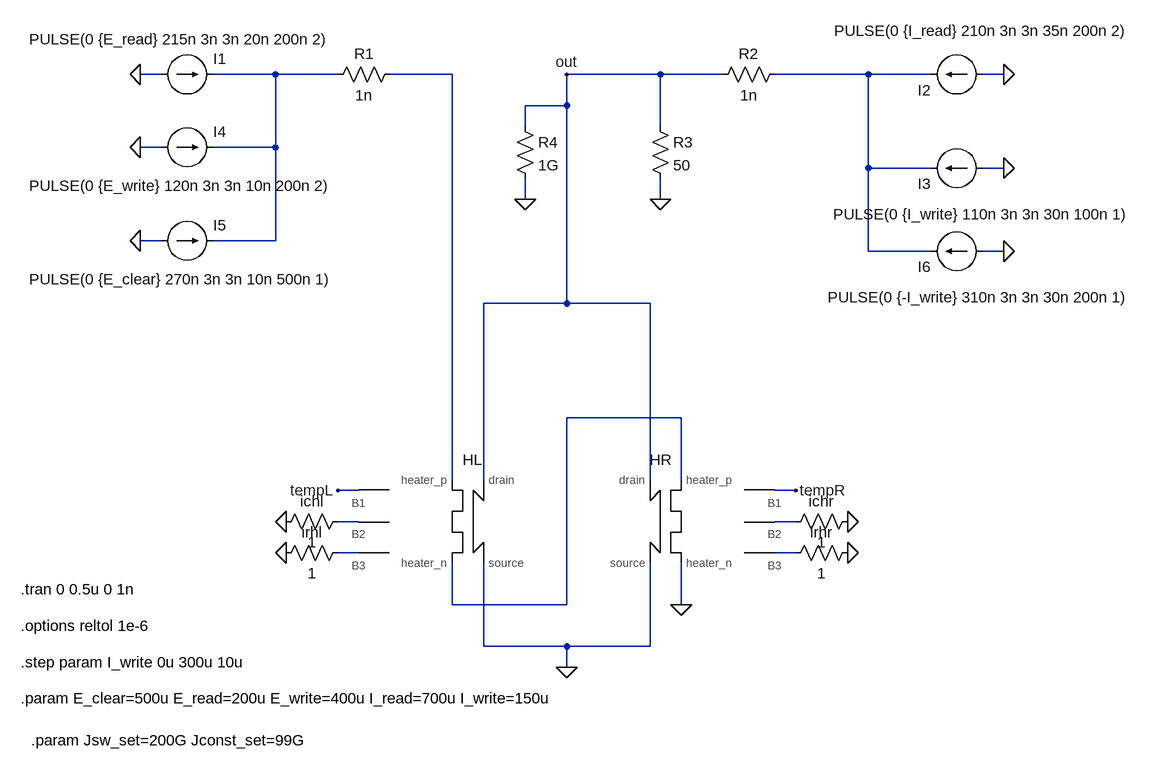
[diagram p0: schematic nmem_cell_write.asc]
nmem_cell_write.asc, the LTspice schematic file:
Version 4.1
SHEET 1 2708 1228
WIRE -400 32 -432 32
WIRE -224 32 -320 32
WIRE -128 32 -224 32
WIRE 48 32 -48 32
WIRE 368 32 224 32
WIRE 464 32 368 32
WIRE 688 32 544 32
WIRE 784 32 688 32
WIRE 896 32 864 32
WIRE 224 80 224 32
WIRE 224 80 160 80
WIRE 160 112 160 80
WIRE 368 112 368 32
WIRE -400 144 -432 144
WIRE -224 144 -224 32
WIRE -224 144 -320 144
WIRE 688 176 688 32
WIRE 784 176 688 176
WIRE 896 176 864 176
WIRE 160 224 160 192
WIRE 368 224 368 192
WIRE -400 288 -432 288
WIRE -224 288 -224 144
WIRE -224 288 -320 288
WIRE 688 304 688 176
WIRE 784 304 688 304
WIRE 896 304 864 304
WIRE 224 384 224 80
WIRE 224 384 96 384
WIRE 352 384 224 384
WIRE 400 560 224 560
WIRE 48 656 48 32
WIRE 96 656 96 384
WIRE 352 656 352 384
WIRE 400 656 400 560
WIRE -96 672 -128 672
WIRE 576 672 544 672
WIRE -96 720 -128 720
WIRE 576 720 544 720
WIRE -96 768 -128 768
WIRE 576 768 544 768
WIRE 48 848 48 784
WIRE 224 848 224 560
WIRE 224 848 48 848
WIRE 400 848 400 784
WIRE 96 912 96 784
WIRE 224 912 96 912
WIRE 352 912 352 784
WIRE 352 912 224 912
WIRE 224 944 224 912
FLAG -432 32 0
FLAG 896 176 0
FLAG 224 32 out
FLAG 224 944 0
FLAG 400 848 0
FLAG 896 32 0
FLAG -432 144 0
FLAG 368 224 0
FLAG -128 672 tempL
FLAG -432 288 0
FLAG 896 304 0
FLAG 160 224 0
FLAG 576 672 tempR
FLAG -208 720 0
FLAG -208 768 0
FLAG 656 768 0
FLAG 656 720 0
SYMBOL current -400 32 R270
WINDOW 0 24 80 VRight 2
WINDOW 3 54 -203 VRight 2
WINDOW 123 0 0 Left 0
WINDOW 39 0 0 Left 0
SYMATTR InstName I1
SYMATTR Value PULSE(0 {E_read} 215n 3n 3n 20n 200n 2)
SYMBOL current 864 32 R90
WINDOW 0 24 80 VRight 2
WINDOW 3 -67 -228 VRight 2
WINDOW 123 0 0 Left 0
WINDOW 39 0 0 Left 0
SYMATTR InstName I2
SYMATTR Value PULSE(0 {I_read} 210n 3n 3n 35n 200n 2)
SYMBOL current 864 176 R90
WINDOW 0 24 80 VRight 2
WINDOW 3 71 -229 VRight 2
WINDOW 123 0 0 Left 0
WINDOW 39 0 0 Left 0
SYMATTR InstName I3
SYMATTR Value PULSE(0 {I_write} 110n 3n 3n 30n 100n 1)
SYMBOL current -400 144 R270
WINDOW 0 24 80 VRight 2
WINDOW 3 -59 -203 VRight 2
WINDOW 123 0 0 Left 0
WINDOW 39 0 0 Left 0
SYMATTR InstName I4
SYMATTR Value PULSE(0 {E_write} 120n 3n 3n 10n 200n 2)
SYMBOL res -144 48 R270
WINDOW 0 32 56 VTop 2
WINDOW 3 0 56 VBottom 2
SYMATTR InstName R1
SYMATTR Value 1n
SYMBOL res 560 16 R90
WINDOW 0 0 56 VBottom 2
WINDOW 3 32 56 VTop 2
SYMATTR InstName R2
SYMATTR Value 1n
SYMBOL res 352 96 R0
SYMATTR InstName R3
SYMATTR Value 50
SYMBOL current -400 288 R270
WINDOW 0 24 80 VRight 2
WINDOW 3 -59 -203 VRight 2
WINDOW 123 0 0 Left 0
WINDOW 39 0 0 Left 0
SYMATTR InstName I5
SYMATTR Value PULSE(0 {E_clear} 270n 3n 3n 10n 500n 1)
SYMBOL current 864 304 R90
WINDOW 0 24 80 VRight 2
WINDOW 3 71 -229 VRight 2
WINDOW 123 0 0 Left 0
WINDOW 39 0 0 Left 0
SYMATTR InstName I6
SYMATTR Value PULSE(0 {-I_write} 310n 3n 3n 30n 200n 1)
SYMBOL res 144 96 R0
SYMATTR InstName R4
SYMATTR Value 1G
SYMBOL hTron_behavioral 112 720 R0
SYMATTR InstName HL
SYMATTR SpiceLine chan_width=300n, heater_width=100n, chan_thickness=23.6n, chan_length=1u, sheet_resistance=78, heater_resistance=300, critical_temp=12.5, substrate_temp=1.3, eta=3, Jsw_tilde={Jsw_set}, Isupp_tilde=440u, Jchanr={Jconst_set}, tau_on=5n, ICh_bias_on=100u, Ih_bias_on=500u
SYMBOL hTron_behavioral 336 720 M0
SYMATTR InstName HR
SYMATTR SpiceLine chan_width=550n, heater_width=100n, chan_thickness=23.6n, chan_length=4.11u, sheet_resistance=78, heater_resistance=300, critical_temp=12.5, substrate_temp=1.3, eta=3, Jsw_tilde={Jsw_set}, Isupp_tilde=540u, Jchanr={Jconst_set}, tau_on=5n, ICh_bias_on=100u, Ih_bias_on=500u
SYMBOL res 560 784 R270
WINDOW 0 32 56 VTop 2
WINDOW 3 0 56 VBottom 2
SYMATTR InstName irhr
SYMATTR Value 1
SYMBOL res 560 736 R270
WINDOW 0 32 56 VTop 2
WINDOW 3 0 56 VBottom 2
SYMATTR InstName ichr
SYMATTR Value 1
SYMBOL res -112 752 R90
WINDOW 0 0 56 VBottom 2
WINDOW 3 32 56 VTop 2
SYMATTR InstName irhl
SYMATTR Value 1
SYMBOL res -112 704 R90
WINDOW 0 0 56 VBottom 2
WINDOW 3 32 56 VTop 2
SYMATTR InstName ichl
SYMATTR Value 1
TEXT -616 992 Left 2 !.param E_clear=500u E_read=200u E_write=400u I_read=700u I_write=150u
TEXT -616 824 Left 2 !.tran 0 0.5u 0 1n
TEXT -616 880 Left 2 !.options reltol 1e-6
TEXT -616 936 Left 2 !.step param I_write 0u 300u 10u
TEXT -600 1056 Left 2 !.param Jsw_set=200G Jconst_set=99G

The netlist it stands for:
* nmem_cell_write.asc
I1 0 N001 PULSE(0 {E_read} 215n 3n 3n 20n 200n 2)
I2 0 N003 PULSE(0 {I_read} 210n 3n 3n 35n 200n 2)
I3 0 N003 PULSE(0 {I_write} 110n 3n 3n 30n 100n 1)
I4 0 N001 PULSE(0 {E_write} 120n 3n 3n 10n 200n 2)
R1 N001 N002 1n
R2 N003 out 1n
R3 out 0 50
I5 0 N001 PULSE(0 {E_clear} 270n 3n 3n 10n 500n 1)
I6 0 N003 PULSE(0 {-I_write} 310n 3n 3n 30n 200n 1)
R4 out 0 1G
X§HL N002 N004 out 0 tempL N005 N007 hTron_behav chan_width=300n, heater_width=100n, chan_thickness=23.6n, chan_length=1u, sheet_resistance=78, heater_resistance=300, critical_temp=12.5, substrate_temp=1.3, eta=3, Jsw_tilde={Jsw_set}, Isupp_tilde=440u, Jchanr={Jconst_set}, tau_on=5n, ICh_bias_on=100u, Ih_bias_on=500u  ; pins heater_p heater_n drain source B1 B2 B3
X§HR N004 0 out 0 tempR N006 N008 hTron_behav chan_width=550n, heater_width=100n, chan_thickness=23.6n, chan_length=4.11u, sheet_resistance=78, heater_resistance=300, critical_temp=12.5, substrate_temp=1.3, eta=3, Jsw_tilde={Jsw_set}, Isupp_tilde=540u, Jchanr={Jconst_set}, tau_on=5n, ICh_bias_on=100u, Ih_bias_on=500u  ; pins heater_p heater_n drain source B1 B2 B3
R§irhr N008 0 1
R§ichr N006 0 1
R§irhl N007 0 1
R§ichl N005 0 1
.param E_clear=500u E_read=200u E_write=400u I_read=700u I_write=150u
.tran 0 0.5u 0 1n
.options reltol 1e-6
.step param I_write 0u 300u 10u
.param Jsw_set=200G Jconst_set=99G
.lib hTron_behavioral.lib
.backanno
.end